# EAGLE design ServoShield_Protorype (EAGLE 7.5.0)
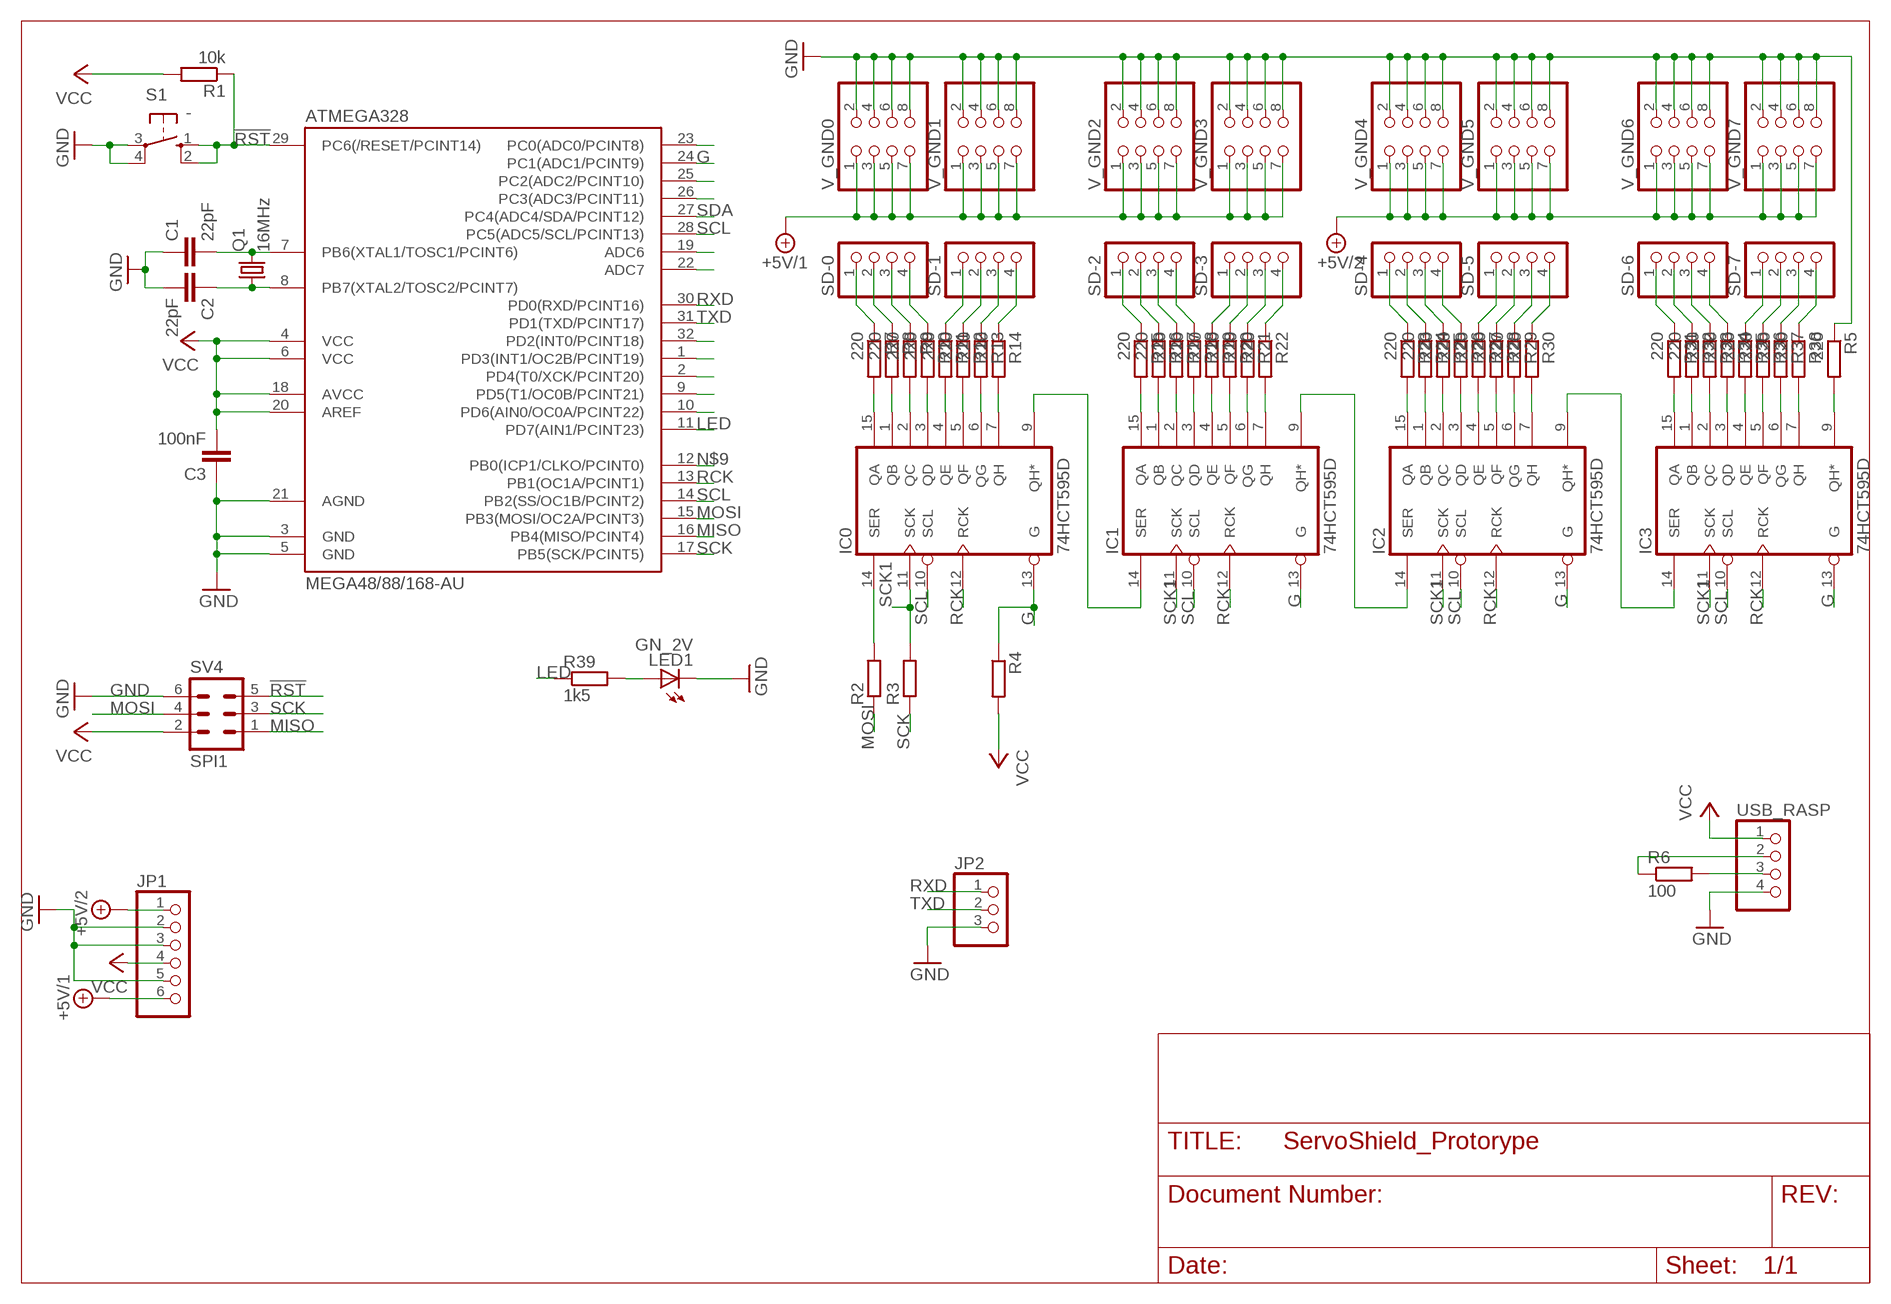
[diagram p0: schematic, sheet 1]

## Parts
ATMEGA328  MEGA48/88/168-AU  [TQFP32-08]
C1  22pF  C-EUC0805  [C0805]
C2  22pF  C-EUC0805  [C0805]
C3  100nF  C-EUC0805  [C0805]
IC0  74HCT595D  [SO16]
IC1  74HCT595D  [SO16]
IC2  74HCT595D  [SO16]
IC3  74HCT595D  [SO16]
JP1  PINHD-1X6  [1X06]
JP2  PINHD-1X3  [1X03]
LED1  GN_2V  LED3MM  [LED3MM]
Q1  16MHz  CRYSTALHC49UP  [HC49UP]
R1  10k  R-EU_R0805  [R0805]
R2  R-EU_R0805  [R0805]
R3  R-EU_R0805  [R0805]
R4  R-EU_R0805  [R0805]
R5  220  R-EU_R0805  [R0805]
R6  100  R-EU_R0805  [R0805]
R7  220  R-EU_R0805  [R0805]
R8  220  R-EU_R0805  [R0805]
R9  220  R-EU_R0805  [R0805]
R10  220  R-EU_R0805  [R0805]
R11  220  R-EU_R0805  [R0805]
R12  220  R-EU_R0805  [R0805]
R13  220  R-EU_R0805  [R0805]
R14  220  R-EU_R0805  [R0805]
R15  220  R-EU_R0805  [R0805]
R16  220  R-EU_R0805  [R0805]
R17  220  R-EU_R0805  [R0805]
R18  220  R-EU_R0805  [R0805]
R19  220  R-EU_R0805  [R0805]
R20  220  R-EU_R0805  [R0805]
R21  220  R-EU_R0805  [R0805]
R22  220  R-EU_R0805  [R0805]
R23  220  R-EU_R0805  [R0805]
R24  220  R-EU_R0805  [R0805]
R25  220  R-EU_R0805  [R0805]
R26  220  R-EU_R0805  [R0805]
R27  220  R-EU_R0805  [R0805]
R28  220  R-EU_R0805  [R0805]
R29  220  R-EU_R0805  [R0805]
R30  220  R-EU_R0805  [R0805]
R31  220  R-EU_R0805  [R0805]
R32  220  R-EU_R0805  [R0805]
R33  220  R-EU_R0805  [R0805]
R34  220  R-EU_R0805  [R0805]
R35  220  R-EU_R0805  [R0805]
R36  220  R-EU_R0805  [R0805]
R37  220  R-EU_R0805  [R0805]
R38  220  R-EU_R0805  [R0805]
R39  1k5  R-EU_R0805  [R0805]
S1  -  10-XX  [B3F-10XX]
SD-0  PINHD-1X4  [1X04]
SD-1  PINHD-1X4  [1X04]
SD-2  PINHD-1X4  [1X04]
SD-3  PINHD-1X4  [1X04]
SD-4  PINHD-1X4  [1X04]
SD-5  PINHD-1X4  [1X04]
SD-6  PINHD-1X4  [1X04]
SD-7  PINHD-1X4  [1X04]
SV4  SPI1  ML6  [ML6]
USB_RASP  PINHD-1X4  [1X04]
V_GND0  PINHD-2X4  [2X04]
V_GND1  PINHD-2X4  [2X04]
V_GND2  PINHD-2X4  [2X04]
V_GND3  PINHD-2X4  [2X04]
V_GND4  PINHD-2X4  [2X04]
V_GND5  PINHD-2X4  [2X04]
V_GND6  PINHD-2X4  [2X04]
V_GND7  PINHD-2X4  [2X04]

## Nets
!RST: ATMEGA328.29(PC6(/RESET/PCINT14)) R1.1 S1.1(S) S1.2(S1) SV4.5
+5V/1: JP1.6 V_GND0.1 V_GND0.3 V_GND0.5 V_GND0.7 V_GND1.1 V_GND1.3 V_GND1.5 V_GND1.7 V_GND2.1 V_GND2.3 V_GND2.5 V_GND2.7 V_GND3.1 V_GND3.3 V_GND3.5 V_GND3.7
+5V/2: JP1.1 V_GND4.1 V_GND4.3 V_GND4.5 V_GND4.7 V_GND5.1 V_GND5.3 V_GND5.5 V_GND5.7 V_GND6.1 V_GND6.3 V_GND6.5 V_GND6.7 V_GND7.1 V_GND7.3 V_GND7.5 V_GND7.7
G: ATMEGA328.24(PC1(ADC1/PCINT9)) IC0.13(G) IC1.13(G) IC2.13(G) IC3.13(G) R4.1
GND: ATMEGA328.3(GND) ATMEGA328.5(GND) ATMEGA328.21(AGND) C1.1 C2.2 C3.1 JP1.2 JP1.3 JP1.5 JP2.3 LED1.K(C) R5.1 S1.3(P) S1.4(P1) SV4.6 USB_RASP.4 V_GND0.2 V_GND0.4 V_GND0.6 V_GND0.8 V_GND1.2 V_GND1.4 V_GND1.6 V_GND1.8 V_GND2.2 V_GND2.4 V_GND2.6 V_GND2.8 V_GND3.2 V_GND3.4 V_GND3.6 V_GND3.8 V_GND4.2 V_GND4.4 V_GND4.6 V_GND4.8 V_GND5.2 V_GND5.4 V_GND5.6 V_GND5.8 V_GND6.2 V_GND6.4 V_GND6.6 V_GND6.8 V_GND7.2 V_GND7.4 V_GND7.6 V_GND7.8
LED: ATMEGA328.11(PD7(AIN1/PCINT23)) R39.1
MISO: ATMEGA328.16(PB4(MISO/PCINT4)) SV4.1
MOSI: ATMEGA328.15(PB3(MOSI/OC2A/PCINT3)) R2.1 SV4.4
N$1: ATMEGA328.8(PB7(XTAL2/TOSC2/PCINT7)) C2.1 Q1.1
N$2: ATMEGA328.7(PB6(XTAL1/TOSC1/PCINT6)) C1.2 Q1.2
N$3: IC0.15(QA) R7.2
N$4: IC0.14(SER) R2.2
N$5: IC1.9(QH*) IC2.14(SER)
N$6: IC0.1(QB) R8.2
N$7: IC0.2(QC) R9.2
N$8: IC0.3(QD) R10.2
N$9: ATMEGA328.12(PB0(ICP1/CLKO/PCINT0))
N$10: ATMEGA328.10(PD6(AIN0/OC0A/PCINT22))
N$11: ATMEGA328.9(PD5(T1/OC0B/PCINT21))
N$12: ATMEGA328.2(PD4(T0/XCK/PCINT20))
N$13: ATMEGA328.1(PD3(INT1/OC2B/PCINT19))
N$14: ATMEGA328.32(PD2(INT0/PCINT18))
N$15: IC0.4(QE) R11.2
N$16: IC0.5(QF) R12.2
N$17: ATMEGA328.22(ADC7)
N$18: ATMEGA328.19(ADC6)
N$19: IC0.6(QG) R13.2
N$20: IC0.7(QH) R14.2
N$21: ATMEGA328.26(PC3(ADC3/PCINT11))
N$22: ATMEGA328.25(PC2(ADC2/PCINT10))
N$24: ATMEGA328.23(PC0(ADC0/PCINT8))
N$25: R7.1 SD-0.1
N$26: R8.1 SD-0.2
N$27: R9.1 SD-0.3
N$28: R10.1 SD-0.4
N$29: R11.1 SD-1.1
N$30: R12.1 SD-1.2
N$31: R13.1 SD-1.3
N$32: R14.1 SD-1.4
N$33: IC1.15(QA) R15.2
N$34: R15.1 SD-2.1
N$35: IC1.1(QB) R16.2
N$36: IC0.9(QH*) IC1.14(SER)
N$37: IC1.2(QC) R17.2
N$38: IC1.3(QD) R18.2
N$39: IC1.4(QE) R19.2
N$40: IC1.5(QF) R20.2
N$41: IC1.6(QG) R21.2
N$42: IC1.7(QH) R22.2
N$43: R16.1 SD-2.2
N$44: R17.1 SD-2.3
N$45: R18.1 SD-2.4
N$46: R19.1 SD-3.1
N$47: R20.1 SD-3.2
N$48: R21.1 SD-3.3
N$49: R22.1 SD-3.4
N$50: IC2.15(QA) R23.2
N$51: IC2.1(QB) R24.2
N$52: IC3.9(QH*) R5.2
N$53: IC2.9(QH*) IC3.14(SER)
N$54: IC2.2(QC) R25.2
N$55: IC2.3(QD) R26.2
N$56: IC2.4(QE) R27.2
N$57: IC2.5(QF) R28.2
N$58: IC2.6(QG) R29.2
N$59: IC2.7(QH) R30.2
N$60: R23.1 SD-4.1
N$61: R24.1 SD-4.2
N$62: R25.1 SD-4.3
N$63: R26.1 SD-4.4
N$64: R27.1 SD-5.1
N$65: R28.1 SD-5.2
N$66: R29.1 SD-5.3
N$67: R30.1 SD-5.4
N$68: IC3.15(QA) R31.2
N$69: IC3.1(QB) R32.2
N$70: IC3.2(QC) R33.2
N$71: IC3.3(QD) R34.2
N$72: IC3.4(QE) R35.2
N$73: IC3.5(QF) R36.2
N$74: IC3.6(QG) R37.2
N$75: IC3.7(QH) R38.2
N$76: R31.1 SD-6.1
N$77: R32.1 SD-6.2
N$78: R33.1 SD-6.3
N$79: R34.1 SD-6.4
N$80: R35.1 SD-7.1
N$81: R36.1 SD-7.2
N$82: R37.1 SD-7.3
N$83: R38.1 SD-7.4
N$84: R6.2 USB_RASP.3
N$85: LED1.A R39.2
N$86: R6.1 USB_RASP.2
RCK: ATMEGA328.13(PB1(OC1A/PCINT1)) IC0.12(RCK) IC1.12(RCK) IC2.12(RCK) IC3.12(RCK)
RXD: ATMEGA328.30(PD0(RXD/PCINT16)) JP2.1
SCK: ATMEGA328.17(PB5(SCK/PCINT5)) R3.1 SV4.3
SCK1: IC0.11(SCK) IC1.11(SCK) IC2.11(SCK) IC3.11(SCK) R3.2
SCL: ATMEGA328.14(PB2(SS/OC1B/PCINT2)) ATMEGA328.28(PC5(ADC5/SCL/PCINT13)) IC0.10(SCL) IC1.10(SCL) IC2.10(SCL) IC3.10(SCL)
SDA: ATMEGA328.27(PC4(ADC4/SDA/PCINT12))
TXD: ATMEGA328.31(PD1(TXD/PCINT17)) JP2.2
VCC: ATMEGA328.4(VCC) ATMEGA328.6(VCC) ATMEGA328.18(AVCC) ATMEGA328.20(AREF) C3.2 JP1.4 R1.2 R4.2 SV4.2 USB_RASP.1

## Power pins joined to a net without a drawn wire
GND: IC0.8(GND) IC1.8(GND) IC2.8(GND) IC3.8(GND)
VCC: IC0.16(VCC) IC1.16(VCC) IC2.16(VCC) IC3.16(VCC)

## Library data of the parts
ATMEGA328 = avr-7:MEGA48/88/168
C1 C2 = rcl:C-EU: CAPACITOR, European symbol
C3 = resistor:C-EU: CAPACITOR, European symbol
IC0 IC1-IC3 = 74xx-eu:74*595: 8-bit SHIFT REGISTER, output latch
JP1 = pinhead:PINHD-1X6: PIN HEADER
JP2 = pinhead:PINHD-1X3: PIN HEADER
LED1 = led:LED: LED OSRAM: - CHIPLED LG R971, LG N971, LY N971, LG Q971, LY Q971, LO R971, LY R971 LH N974, LH R974 LS Q976, LO Q976, LY Q976 LO Q996 - Hyper CHIPLED LW Q18S LB Q993, LB Q99A, LB R99A - SideLED LS A670, LO A670, LY A670, LG A670, LP A670 LB A673, LV A673, LT A673, LW A673 LH A674 LY A675 LS A676, LA A676, LO A676, LY A676, LW A676 LS A679, LY A679, LG A679 - Hyper Micro SIDELED® LS Y876, LA Y876, LO Y876, LY Y876 LT Y87S - SmartLED LW L88C, LW L88S LB L89C, LB L89S, LG L890 LS L89K, LO L89K, LY L89K LS L896, LA L896, LO L896, LY L896 - TOPLED LS T670, LO T670, LY T670, LG T670, LP T670 LSG T670, LSP T670, LSY T670, LOP T670, LYG T670 LG T671, LOG T671, LSG T671 LB T673, LV T673, LT T673, LW T673 LH T674 LS T676, LA T676, LO T676, LY T676, LB T676, LH T676, LSB T676, LW T676 LB T67C, LV T67C, LT T67C, LS T67K, LO T67K, LY T67K, LW E67C LS E67B, LA E67B, LO E67B, LY E67B, LB E67C, LV E67C, LT E67C LW T67C LS T679, LY T679, LG T679 LS T770, LO T770, LY T770, LG T770, LP T770 LB T773, LV T773, LT T773, LW T773 LH T774 LS E675, LA E675, LY E675, LS T675 LS T776, LA T776, LO T776, LY T776, LB T776 LHGB T686 LT T68C, LB T68C - Hyper Mini TOPLED® LB M676 - Mini TOPLED Santana® LG M470 LS M47K, LO M47K, LY M47K Source: http://www.osram.convergy.de LUXEON: - LUMILED® LXK2-PW12-R00, LXK2-PW12-S00, LXK2-PW14-U00, LXK2-PW14-V00 LXK2-PM12-R00, LXK2-PM12-S00, LXK2-PM14-U00 LXK2-PE12-Q00, LXK2-PE12-R00, LXK2-PE12-S00, LXK2-PE14-T00, LXK2-PE14-U00 LXK2-PB12-K00, LXK2-PB12-L00, LXK2-PB12-M00, LXK2-PB14-N00, LXK2-PB14-P00, LXK2-PB14-Q00 LXK2-PR12-L00, LXK2-PR12-M00, LXK2-PR14-Q00, LXK2-PR14-R00 LXK2-PD12-Q00, LXK2-PD12-R00, LXK2-PD12-S00 LXK2-PH12-R00, LXK2-PH12-S00 LXK2-PL12-P00, LXK2-PL12-Q00, LXK2-PL12-R00 Source: www.luxeon.com KINGBRIGHT: KA-3528ASYC Source: www.kingbright.com
Q1 = crystal:CRYSTAL: CRYSTAL; OC_FARNELL: unknown; OC_NEWARK: unknown
R1 = resistor:R-EU_: RESISTOR, European symbol
R2-R39 = rcl:R-EU_: RESISTOR, European symbol
S1 = switch-omron:10-XX: OMRON SWITCH; MPN: B3F-1000; OC_FARNELL: 176432; OC_NEWARK: 36M3542
SD-0 SD-1-SD-7 USB_RASP = pinhead:PINHD-1X4: PIN HEADER
SV4 = con-harting-ml:ML6: HARTING; OC_FARNELL: unknown; OC_NEWARK: unknown
V_GND0 V_GND1-V_GND7 = pinhead:PINHD-2X4: PIN HEADER

## Board
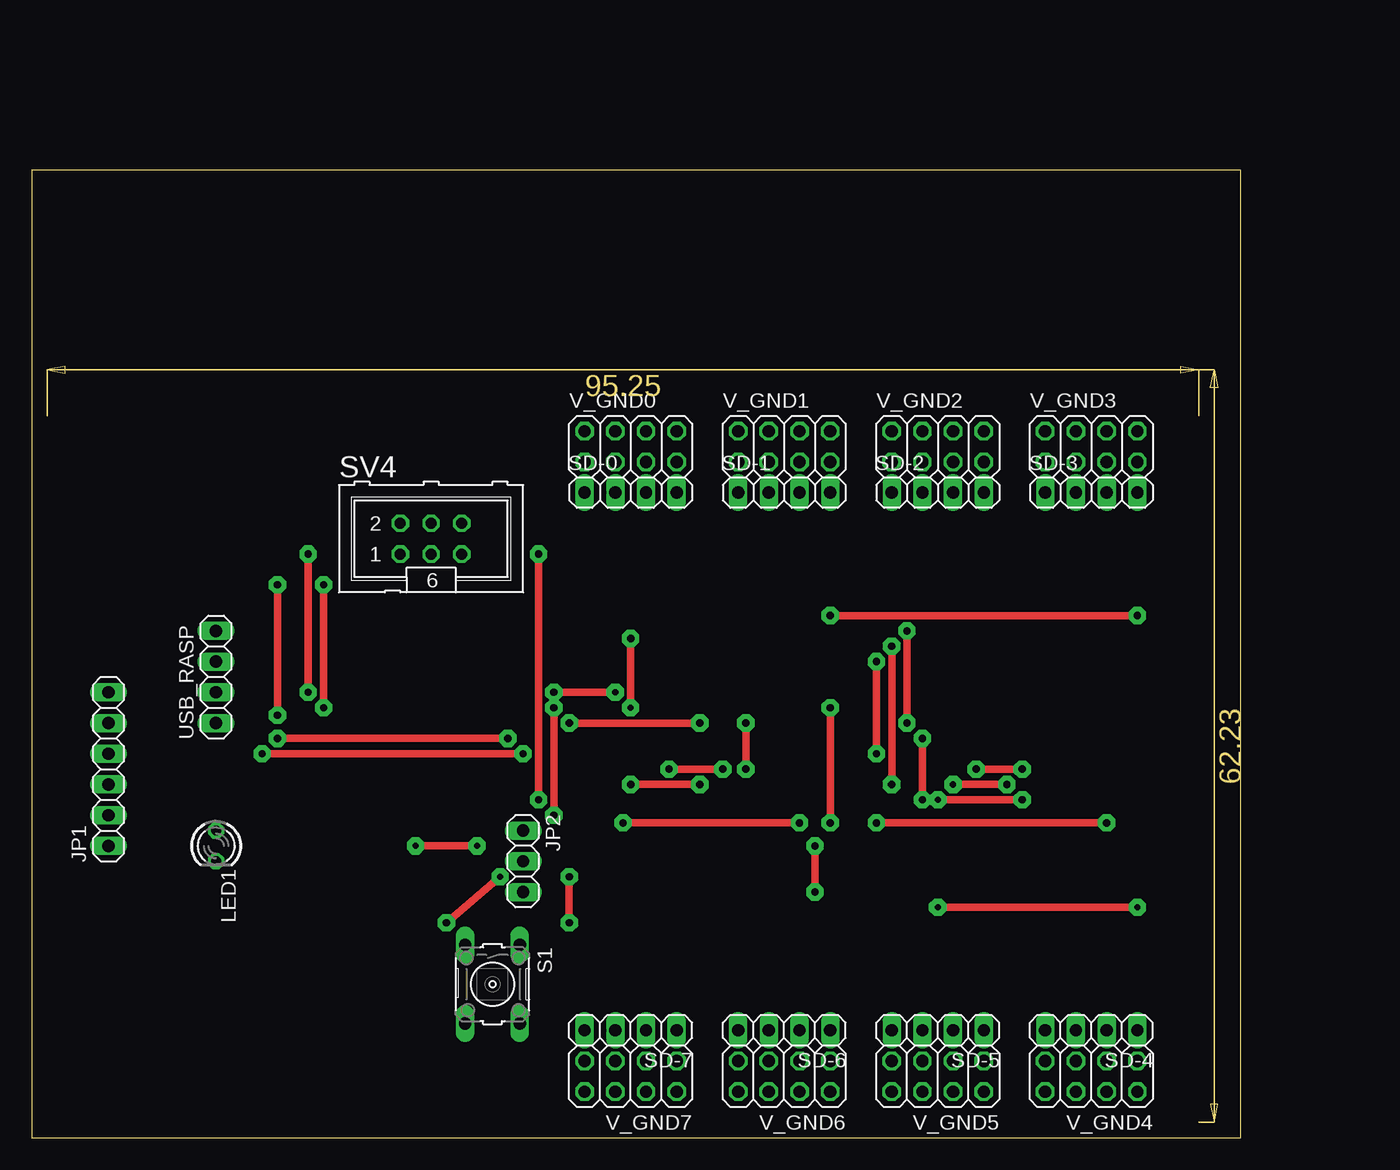
[diagram p1: board, top side]
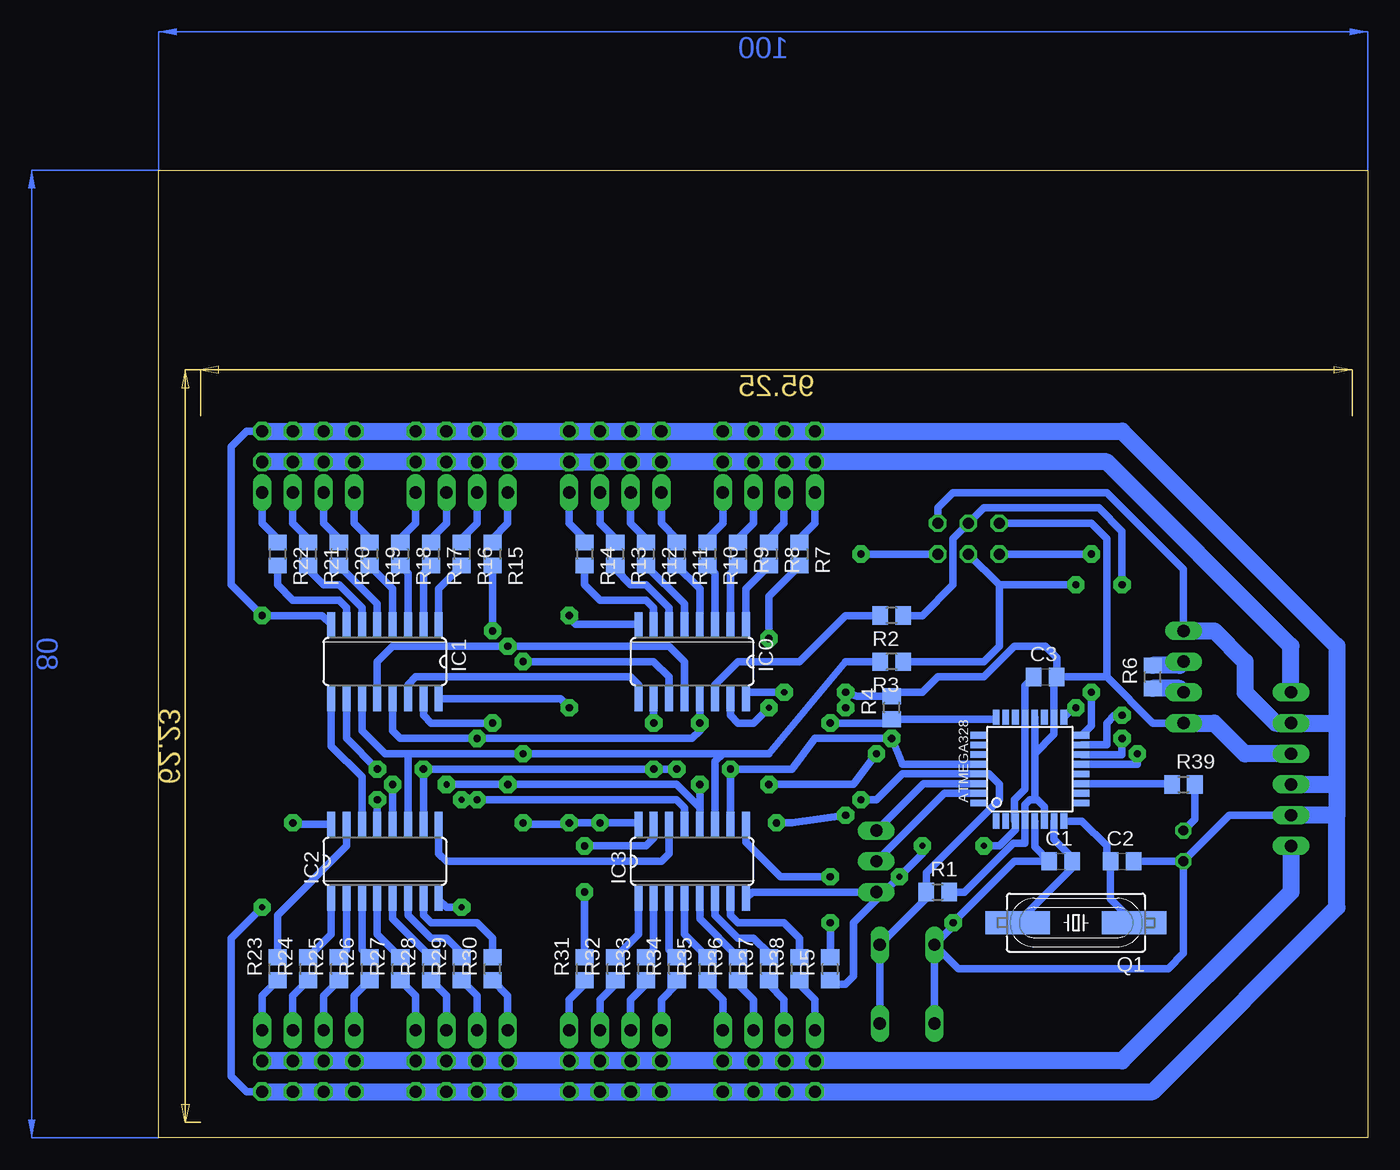
[diagram p2: board, bottom side, seen from below]

Size 100 x 80 mm. Coordinates in mm from the lower left corner, seen from the top.
Outline: 0,0 100,0 100,80 0,80 0,0
Copper layers (1*16): Top 0.035mm / dielectric 1.5mm / Bottom 0.035mm
Design rules "default": minimum track width 10mil, minimum drill 24mil, track to track 8mil, track to pad 8mil, pad to pad 8mil, via to via 8mil, smd to smd 8mil, copper to edge 40mil, drill to drill 8mil, minimum pad ring 10mil, minimum via ring 8mil, stop-mask expansion 4mil, vias tented up to drill 0mil, thermal gap 10mil

### Footprints (pad centres in the part's own frame; a part is rotated, then mirrored left to right if it is on the bottom)
TQFP32-08 = smd 1.27 x 0.559: 1 -4.293,2.8; 2 -4.293,2; 3 -4.293,1.2; 4 -4.293,0.4; 5 -4.293,-0.4; 6 -4.293,-1.2; 7 -4.293,-2; 8 -4.293,-2.8; 17 4.293,-2.8; 18 4.293,-2; 19 4.293,-1.2; 20 4.293,-0.4; 21 4.293,0.4; 22 4.293,1.2; 23 4.293,2; 24 4.293,2.8 | smd 0.559 x 1.27: 9 -2.8,-4.293; 10 -2,-4.293; 11 -1.2,-4.293; 12 -0.4,-4.293; 13 0.4,-4.293; 14 1.2,-4.293; 15 2,-4.293; 16 2.8,-4.293; 25 2.8,4.293; 26 2,4.293; 27 1.2,4.293; 28 0.4,4.293; 29 -0.4,4.293; 30 -1.2,4.293; 31 -2,4.293; 32 -2.8,4.293
C0805 = smd 1.3 x 1.5: 1 -0.95,0; 2 0.95,0
SO16 = smd 0.66 x 2.032: 1 -4.445,-3.073; 2 -3.175,-3.073; 3 -1.905,-3.073; 4 -0.635,-3.073; 5 0.635,-3.073; 6 1.905,-3.073; 7 3.175,-3.073; 8 4.445,-3.073; 9 4.445,3.073; 10 3.175,3.073; 11 1.905,3.073; 12 0.635,3.073; 13 -0.635,3.073; 14 -1.905,3.073; 15 -3.175,3.073; 16 -4.445,3.073
1X06 = drill 1.016 long: 1 -6.35,0; 2 -3.81,0; 3 -1.27,0; 4 1.27,0; 5 3.81,0; 6 6.35,0
1X03 = drill 1.016 long: 1 -2.54,0; 2 0,0; 3 2.54,0
LED3MM = drill 0.813 octagon: A -1.27,0; K 1.27,0
HC49UP = smd 5.334 x 1.93: 1 -4.826,0; 2 4.826,0
R0805 = smd 1.3 x 1.5: 1 -0.95,0; 2 0.95,0
B3F-10XX = drill 1.016 long: 1 -3.251,2.261; 2 3.251,2.261; 3 -3.251,-2.261; 4 3.251,-2.261
1X04 = drill 1.016 long: 1 -3.81,0; 2 -1.27,0; 3 1.27,0; 4 3.81,0
ML6 = drill 0.914 octagon: 1 -2.54,-1.27; 2 -2.54,1.27; 3 0,-1.27; 4 0,1.27; 5 2.54,-1.27; 6 2.54,1.27
2X04 = drill 1.016 octagon: 1 -3.81,-1.27; 2 -3.81,1.27; 3 -1.27,-1.27; 4 -1.27,1.27; 5 1.27,-1.27; 6 1.27,1.27; 7 3.81,-1.27; 8 3.81,1.27

### Placement (x,y rotation side)
ATMEGA328  27.94,30.48 90 bottom
C1  25.4,22.86 0 bottom
C2  20.32,22.86 0 bottom
C3  26.67,38.1 0 bottom
IC0  55.88,39.37 180 bottom
IC1  81.28,39.37 180 bottom
IC2  81.28,22.86 0 bottom
IC3  55.88,22.86 0 bottom
JP1  6.35,30.48 90 top
JP2  40.64,22.86 270 top
LED1  15.24,24.13 270 top
Q1  24.13,17.78 180 bottom
R1  35.56,20.32 0 bottom
R2  39.37,43.18 180 bottom
R3  39.37,39.37 180 bottom
R4  39.37,35.56 90 bottom
R5  44.45,13.97 90 bottom
R6  17.78,38.1 90 bottom
R7  46.99,48.26 270 bottom
R8  49.53,48.26 270 bottom
R9  52.07,48.26 270 bottom
R10  54.61,48.26 270 bottom
R11  57.15,48.26 270 bottom
R12  59.69,48.26 270 bottom
R13  62.23,48.26 270 bottom
R14  64.77,48.26 270 bottom
R15  72.39,48.26 270 bottom
R16  74.93,48.26 270 bottom
R17  77.47,48.26 270 bottom
R18  80.01,48.26 270 bottom
R19  82.55,48.26 270 bottom
R20  85.09,48.26 270 bottom
R21  87.63,48.26 270 bottom
R22  90.17,48.26 270 bottom
R23  90.17,13.97 90 bottom
R24  87.63,13.97 90 bottom
R25  85.09,13.97 90 bottom
R26  82.55,13.97 90 bottom
R27  80.01,13.97 90 bottom
R28  77.47,13.97 90 bottom
R29  74.93,13.97 90 bottom
R30  72.39,13.97 90 bottom
R31  64.77,13.97 90 bottom
R32  62.23,13.97 90 bottom
R33  59.69,13.97 90 bottom
R34  57.15,13.97 90 bottom
R35  54.61,13.97 90 bottom
R36  52.07,13.97 90 bottom
R37  49.53,13.97 90 bottom
R38  46.99,13.97 90 bottom
R39  15.24,29.21 0 bottom
S1  38.1,12.7 270 top
SD-0  49.53,53.34 0 top
SD-1  62.23,53.34 0 top
SD-2  74.93,53.34 0 top
SD-3  87.63,53.34 0 top
SD-4  87.63,8.89 180 top
SD-5  74.93,8.89 180 top
SD-6  62.23,8.89 180 top
SD-7  49.53,8.89 180 top
SV4  33.02,49.53 0 top
USB_RASP  15.24,38.1 90 top
V_GND0  49.53,57.15 0 top
V_GND1  62.23,57.15 0 top
V_GND2  74.93,57.15 0 top
V_GND3  87.63,57.15 0 top
V_GND4  87.63,5.08 180 top
V_GND5  74.93,5.08 180 top
V_GND6  62.23,5.08 180 top
V_GND7  49.53,5.08 180 top

### Tracks (layer width: path | path; a pad name or v marks a point on that pad's centre or on a via)
!RST  (via drill 0.5 pad 1.42, 0.6)
  Top 0.61: v41.91,48.26 v41.91,27.94
  Bottom 0.61: S1.2 S1.1 36.51,19.8 R1.1 36.51,21.91 30.48,27.94 30.48,29.21 31.35,30.08 ATMEGA328.29 38.5,30.08 40.64,27.94 v41.91,27.94 | SV4.5 v41.91,48.26
+5V/1
  Bottom 1.422: V_GND3.7 V_GND3.5 V_GND3.3 V_GND3.1 V_GND2.7 V_GND2.5 V_GND2.3 V_GND2.1 V_GND1.7 V_GND1.5 V_GND1.3 V_GND1.1 V_GND0.7 V_GND0.5 V_GND0.3 V_GND0.1 21.59,55.88 6.35,40.64 JP1.6
+5V/2
  Bottom 1.422: JP1.1 6.35,20.32 20.32,6.35 V_GND7.7 V_GND7.5 V_GND7.3 V_GND7.1 V_GND6.7 V_GND6.5 V_GND6.3 V_GND6.1 V_GND5.7 V_GND5.5 V_GND5.3 V_GND5.1 V_GND4.7 V_GND4.5 V_GND4.3 V_GND4.1
G  (via drill 0.5 pad 1.42, 0.6)
  Top 0.61: v74.93,27.94 v81.92,27.94 | v73.66,27.94 v73.66,33.02 | v44.45,34.29 v55.24,34.29
  Bottom 0.61: IC0.13 v55.24,34.29 55.24,33.66 55.88,33.02 v73.66,33.02 80.01,33.02 80.64,33.66 IC1.13 | IC3.13 56.52,27.3 57.15,27.94 v73.66,27.94 v74.93,27.94 | v81.92,27.94 IC2.13 | ATMEGA328.24 30.9,34.61 R4.1 39.69,34.29 v44.45,34.29
GND  (via drill 0.5 pad 1.42, 0.6)
  Top 0.61: v34.29,17.78 v38.73,21.59 | v66.04,43.18 v91.44,43.18 | v74.93,19.05 v91.44,19.05 | v31.75,24.13 v36.83,24.13
  Bottom 0.61: IC1.8 86.46,43.18 v91.44,43.18 93.98,45.72 93.98,57.15 92.71,58.42 V_GND3.8 | LED1.K 11.43,26.67 JP1.2 | C2.2 LED1.K | ATMEGA328.5 27.54,24.05 C1.1 29.21,22.86 v34.29,17.78 34.29,17.5 S1.3 | C3.1 28.34,37.38 ATMEGA328.21 28.34,28.81 29.21,27.94 29.21,26.26 ATMEGA328.3 29.14,25.47 30.48,24.13 v31.75,24.13 | S1.3 S1.4 | S1.3 33.86,13.97 16.51,13.97 15.24,15.24 LED1.K | R5.1 44.13,12.7 43.18,12.7 42.55,13.34 42.55,17.78 40.64,19.68 | 40.64,19.68 JP2.3 50.9,20.32 IC3.8 | 40.64,19.68 v38.73,21.59 36.83,23.5 v36.83,24.13 | SV4.6 35.56,52.07 34.29,53.34 21.59,53.34 15.24,46.99 USB_RASP.4 | IC0.8 65.51,42.44 v66.04,43.18 | IC2.8 76.83,19.68 76.2,19.05 v74.93,19.05 | v91.44,19.05 93.98,16.51 93.98,5.08 92.71,3.81 V_GND4.2
  Bottom 1.422: V_GND3.8 V_GND3.6 V_GND3.4 V_GND3.2 V_GND2.8 V_GND2.6 V_GND2.4 V_GND2.2 V_GND1.8 V_GND1.6 V_GND1.4 V_GND1.2 V_GND0.8 V_GND0.6 V_GND0.4 V_GND0.2 20.32,58.42 2.54,40.64 2.54,34.29 | 2.54,34.29 2.54,29.21 | 2.54,29.21 2.54,26.67 | 2.54,26.67 JP1.2 | 2.54,34.29 JP1.5 7.62,34.29 10.16,36.83 10.16,39.37 12.7,41.91 USB_RASP.4 | JP1.3 2.54,29.21 | V_GND4.2 V_GND4.4 V_GND4.6 V_GND4.8 V_GND5.2 V_GND5.4 V_GND5.6 V_GND5.8 V_GND6.2 V_GND6.4 V_GND6.6 V_GND6.8 V_GND7.2 V_GND7.4 V_GND7.6 V_GND7.8 17.78,3.81 2.54,19.05 2.54,26.67
LED
  Bottom 0.61: ATMEGA328.11 16.26,29.28 R39.1
MISO  (via drill 0.5 pad 1.42, 0.6)
  Top 0.61: v22.86,48.26 v22.86,36.83
  Bottom 0.61: SV4.1 v22.86,48.26 | ATMEGA328.16 22.86,34.07 v22.86,36.83
MOSI  (via drill 0.5 pad 1.42, 0.6)
  Top 0.61: v20.32,34.92 v20.32,45.72
  Bottom 0.61: ATMEGA328.15 21.59,32.48 21.59,34.29 20.95,34.92 v20.32,34.92 | R2.1 36.83,43.18 34.29,45.72 34.29,49.53 SV4.4 31.75,52.07 22.23,52.07 20.32,50.16 v20.32,45.72
N$1
  Bottom 0.61: Q1.1 21.27,19.75 C2.1 21.59,23.18 21.59,24.13 23.65,26.19 ATMEGA328.8
N$2
  Bottom 0.61: Q1.2 24.45,22.29 C1.2 24.45,23.18 25.94,24.67 ATMEGA328.7
N$3  (via drill 0.5 pad 1.42, 0.6)
  Top 0.61: v49.53,41.27 v49.53,35.56
  Bottom 0.61: R7.2 49.53,44.77 v49.53,41.27 | IC0.15 52.7,34.92 52.07,34.29 50.8,34.29 v49.53,35.56
N$4
  Bottom 0.61: IC0.14 53.98,37.47 52.07,39.37 46.99,39.37 43.18,43.18 R2.2
N$5
  Bottom 0.61: IC1.9 85.72,32.38 83.19,29.84 IC2.14
N$6
  Bottom 0.61: R8.2 51.44,45.41 IC0.1
N$7
  Bottom 0.61: R9.2 52.7,46.67 IC0.2
N$8
  Bottom 0.61: R10.2 53.98,46.67 IC0.3
N$15
  Bottom 0.61: R11.2 55.24,45.41 IC0.4
N$16
  Bottom 0.61: R12.2 56.52,44.13 IC0.5
N$19
  Bottom 0.61: R13.2 62.23,46.99 60.96,45.72 59.69,45.72 57.78,43.81 IC0.6
N$20
  Bottom 0.61: IC0.7 59.05,43.81 59.69,44.45 63.5,44.45 64.77,45.72 R14.2
N$25
  Bottom 0.61: R7.1 46.99,49.53 45.72,50.8 SD-0.1
N$26
  Bottom 0.61: R8.1 49.53,49.53 48.26,50.8 SD-0.2
N$27
  Bottom 0.61: R9.1 52.07,49.53 50.8,50.8 SD-0.3
N$28
  Bottom 0.61: R10.1 54.61,49.53 53.34,50.8 SD-0.4
N$29
  Bottom 0.61: R11.1 57.15,49.53 58.42,50.8 SD-1.1
N$30
  Bottom 0.61: R12.1 59.69,49.53 60.96,50.8 SD-1.2
N$31
  Bottom 0.61: R13.1 62.23,49.53 63.5,50.8 SD-1.3
N$32
  Bottom 0.61: R14.1 64.77,49.53 66.04,50.8 SD-1.4
N$33  (via drill 0.5 pad 1.42, 0.6)
  Top 0.61: v72.39,41.91 v72.39,34.29
  Bottom 0.61: IC1.15 78.11,34.92 77.47,34.29 v72.39,34.29 | R15.2 v72.39,41.91
N$34
  Bottom 0.61: R15.1 72.39,49.53 71.12,50.8 SD-2.1
N$35
  Bottom 0.61: R16.2 76.83,45.41 IC1.1
N$36
  Bottom 0.61: IC0.9 60.33,37.47 60.96,38.1 78.74,38.1 79.38,37.47 IC1.14
N$37
  Bottom 0.61: R17.2 78.11,46.67 IC1.2
N$38
  Bottom 0.61: R18.2 79.38,46.67 IC1.3
N$39
  Bottom 0.61: R19.2 80.64,45.41 IC1.4
N$40
  Bottom 0.61: R20.2 81.92,44.13 IC1.5
N$41
  Bottom 0.61: R21.2 87.63,46.99 86.36,45.72 85.09,45.72 83.19,43.81 IC1.6
N$42
  Bottom 0.61: R22.2 90.17,45.72 88.9,44.45 85.09,44.45 84.45,43.81 IC1.7
N$43
  Bottom 0.61: R16.1 74.93,49.53 73.66,50.8 SD-2.2
N$44
  Bottom 0.61: R17.1 77.47,49.53 76.2,50.8 SD-2.3
N$45
  Bottom 0.61: R18.1 80.01,49.53 78.74,50.8 SD-2.4
N$46
  Bottom 0.61: R19.1 82.55,49.53 83.82,50.8 SD-3.1
N$47
  Bottom 0.61: R20.1 85.09,49.53 86.36,50.8 SD-3.2
N$48
  Bottom 0.61: R21.1 87.63,49.53 88.9,50.8 SD-3.3
N$49
  Bottom 0.61: R22.1 90.17,49.53 91.44,50.8 SD-3.4
N$50
  Bottom 0.61: IC2.15 84.45,24.13 90.17,18.41 R23.2
N$51
  Bottom 0.61: R24.2 85.72,16.82 IC2.1
N$52  (via drill 0.5 pad 1.42, 0.6)
  Top 0.61: v44.45,17.78 v44.45,21.59
  Bottom 0.61: IC3.9 51.44,24.45 48.58,21.59 v44.45,21.59 | R5.2 v44.45,17.78
N$53
  Bottom 0.61: IC2.9 76.83,23.5 76.2,22.86 58.42,22.86 57.78,23.5 IC3.14
N$54
  Bottom 0.61: R25.2 84.45,15.55 IC2.2
N$55
  Bottom 0.61: R26.2 83.19,15.55 IC2.3
N$56
  Bottom 0.61: R27.2 81.92,16.82 IC2.4
N$57
  Bottom 0.61: R28.2 80.64,18.09 IC2.5
N$58
  Bottom 0.61: R29.2 74.93,15.24 76.2,16.51 77.47,16.51 79.38,18.41 IC2.6
N$59
  Bottom 0.61: R30.2 72.39,16.51 73.66,17.78 77.47,17.78 78.11,18.41 IC2.7
N$60
  Bottom 0.61: R23.1 91.44,11.75 SD-4.1
N$61
  Bottom 0.61: R24.1 88.9,11.75 SD-4.2
N$62
  Bottom 0.61: R25.1 86.36,11.75 SD-4.3
N$63
  Bottom 0.61: R26.1 83.82,11.75 SD-4.4
N$64
  Bottom 0.61: R27.1 78.74,11.75 SD-5.1
N$65
  Bottom 0.61: R28.1 76.2,11.75 SD-5.2
N$66
  Bottom 0.61: R29.1 73.66,11.75 SD-5.3
N$67
  Bottom 0.61: R30.1 71.12,11.75 SD-5.4
N$68  (via drill 0.5 pad 1.42, 0.6)
  Top 0.61: v64.77,24.13 v64.77,20.32
  Bottom 0.61: IC3.15 59.05,24.77 59.69,24.13 v64.77,24.13 | R31.2 v64.77,20.32
N$69
  Bottom 0.61: R32.2 60.33,16.82 IC3.1
N$70
  Bottom 0.61: R33.2 59.05,15.55 IC3.2
N$71
  Bottom 0.61: R34.2 57.78,15.55 IC3.3
N$72
  Bottom 0.61: R35.2 56.52,16.82 IC3.4
N$73
  Bottom 0.61: R36.2 55.24,18.09 IC3.5
N$74
  Bottom 0.61: R37.2 49.53,15.24 50.8,16.51 52.07,16.51 53.98,18.41 IC3.6
N$75
  Bottom 0.61: R38.2 46.99,16.51 48.26,17.78 52.07,17.78 52.7,18.41 IC3.7
N$76
  Bottom 0.61: R31.1 64.77,12.7 66.04,11.43 SD-6.1
N$77
  Bottom 0.61: R32.1 62.23,12.7 63.5,11.43 SD-6.2
N$78
  Bottom 0.61: R33.1 59.69,12.7 60.96,11.43 SD-6.3
N$79
  Bottom 0.61: R34.1 57.15,12.7 58.42,11.43 SD-6.4
N$80
  Bottom 0.61: R35.1 54.61,12.7 53.34,11.43 SD-7.1
N$81
  Bottom 0.61: R36.1 52.07,12.7 50.8,11.43 SD-7.2
N$82
  Bottom 0.61: R37.1 49.53,12.7 48.26,11.43 SD-7.3
N$83
  Bottom 0.61: R38.1 46.99,12.7 45.72,11.43 SD-7.4
N$84
  Bottom 1.422: USB_RASP.3 15.56,39.05 R6.2
N$85
  Bottom 0.61: LED1.A 14.29,26.35 R39.2
N$86
  Bottom 1.422: USB_RASP.2 15.56,37.15 R6.1
RCK  (via drill 0.5 pad 1.42, 0.6)
  Top 0.61: v76.2,29.21 v80.64,29.21 | v71.12,40.64 v71.12,29.21 | v19.05,31.75 v40.64,31.75 | v49.53,29.21 v55.24,29.21
  Bottom 0.61: IC3.12 55.24,27.3 | 55.24,27.3 57.15,29.21 v71.12,29.21 v76.2,29.21 | IC2.12 v80.64,29.21 | IC1.12 81.92,39.37 80.64,40.64 v71.12,40.64 57.78,40.64 56.52,39.37 IC0.12 | ATMEGA328.13 19.05,30.88 v19.05,31.75 | 55.24,27.3 v55.24,29.21 | v40.64,31.75 42.55,29.21 v49.53,29.21
RXD
  Bottom 0.61: JP2.1 36.76,29.28 ATMEGA328.30
SCK  (via drill 0.5 pad 1.42, 0.6)
  Top 0.61: v24.13,45.72 v24.13,35.56
  Bottom 0.61: ATMEGA328.17 24.35,35.56 v24.13,35.56 | SV4.3 30.48,45.72 | 30.48,45.72 v24.13,45.72 | R3.1 31.75,39.37 30.48,40.64 30.48,45.72
SCK1  (via drill 0.5 pad 1.42, 0.6)
  Top 0.61: v69.85,39.37 v69.85,31.75
  Bottom 0.61: R3.2 43.18,39.37 49.53,31.75 53.34,31.75 | 53.34,31.75 v69.85,31.75 79.38,31.75 | IC1.11 83.19,33.66 81.28,31.75 79.38,31.75 | IC2.11 79.38,31.75 | IC3.11 53.98,31.11 53.34,31.75 | IC0.11 57.78,38.1 59.05,39.37 v69.85,39.37
SCL  (via drill 0.5 pad 1.42, 0.6)
  Top 0.61: v78.11,30.48 v81.92,30.48 | v59.05,34.29 v59.05,30.48 | v57.15,30.48 v52.7,30.48 | v20.32,33.02 v39.37,33.02
  Bottom 0.61: IC1.10 84.45,33.02 v81.92,30.48 | IC0.10 v59.05,34.29 | IC2.10 v78.11,30.48 v59.05,30.48 v57.15,30.48 | IC3.10 v52.7,30.48 47.62,30.48 45.72,33.02 v39.37,33.02 38.5,30.88 ATMEGA328.28 | ATMEGA328.14 20.32,31.68 v20.32,33.02
TXD
  Bottom 0.61: JP2.2 35.02,28.48 ATMEGA328.31
VCC  (via drill 0.5 pad 1.42, 0.6)
  Top 0.61: v43.18,36.83 v48.26,36.83 | v69.85,26.04 v88.9,26.04 | v66.04,35.56 v66.04,26.04 | v63.5,26.04 v48.9,26.04 | v43.18,26.67 v43.18,35.56
  Bottom 0.61: R1.2 33.34,20.32 29.3,24.36 28.34,24.36 ATMEGA328.4 28.34,27.54 27.94,27.94 27.54,27.94 | ATMEGA328.6 26.74,27.38 27.3,27.94 27.54,27.94 | ATMEGA328.20 27.54,31.75 | 27.54,31.75 27.54,27.94 | 27.54,31.75 25.94,33.35 ATMEGA328.18 25.94,37.88 C3.2 | USB_RASP.1 17.78,34.29 21.59,38.1 | C3.2 21.59,38.1 | SV4.2 22.86,50.8 21.59,49.53 21.59,38.1 | C3.2 25.72,39.69 26.67,40.64 29.21,40.64 31.75,38.1 35.56,38.1 36.83,36.83 39.05,36.83 R4.2 42.23,36.51 v43.18,36.83 v43.18,35.56 | v69.85,26.04 69.75,25.93 66.14,25.93 v66.04,26.04 v63.5,26.04 60.33,26.04 IC3.16 | IC2.16 88.8,25.93 v88.9,26.04 | IC1.16 66.78,36.3 v66.04,35.56 | v48.9,26.04 47.62,26.04 v43.18,26.67 | v48.26,36.83 51.44,36.83 IC0.16
  Bottom 1.422: JP1.4 10.16,31.75 12.7,34.29 USB_RASP.1
(copper drawn outside any net)
  shapes: Bottom area x2